# Altium schematic sheet [Acoustics] Hydrophone Process.SchDoc: Sample Sheet Title
size B; Date: 10/22/2023; Author: Nathan A, Rebecca Y, Rebecca L; Organization: ORGANIZATION; Address1: ADDRESS 1; Address2: ADDRESS 2; Address3: ADDRESS 3; Address4: ADDRESS 4; Revision: -; SheetNumber: 2; SheetTotal: 6; ENG_APP_DATE: --/--/--; DSN_APP_DATE: --/--/--; CHK_APP_DATE: --/--/--
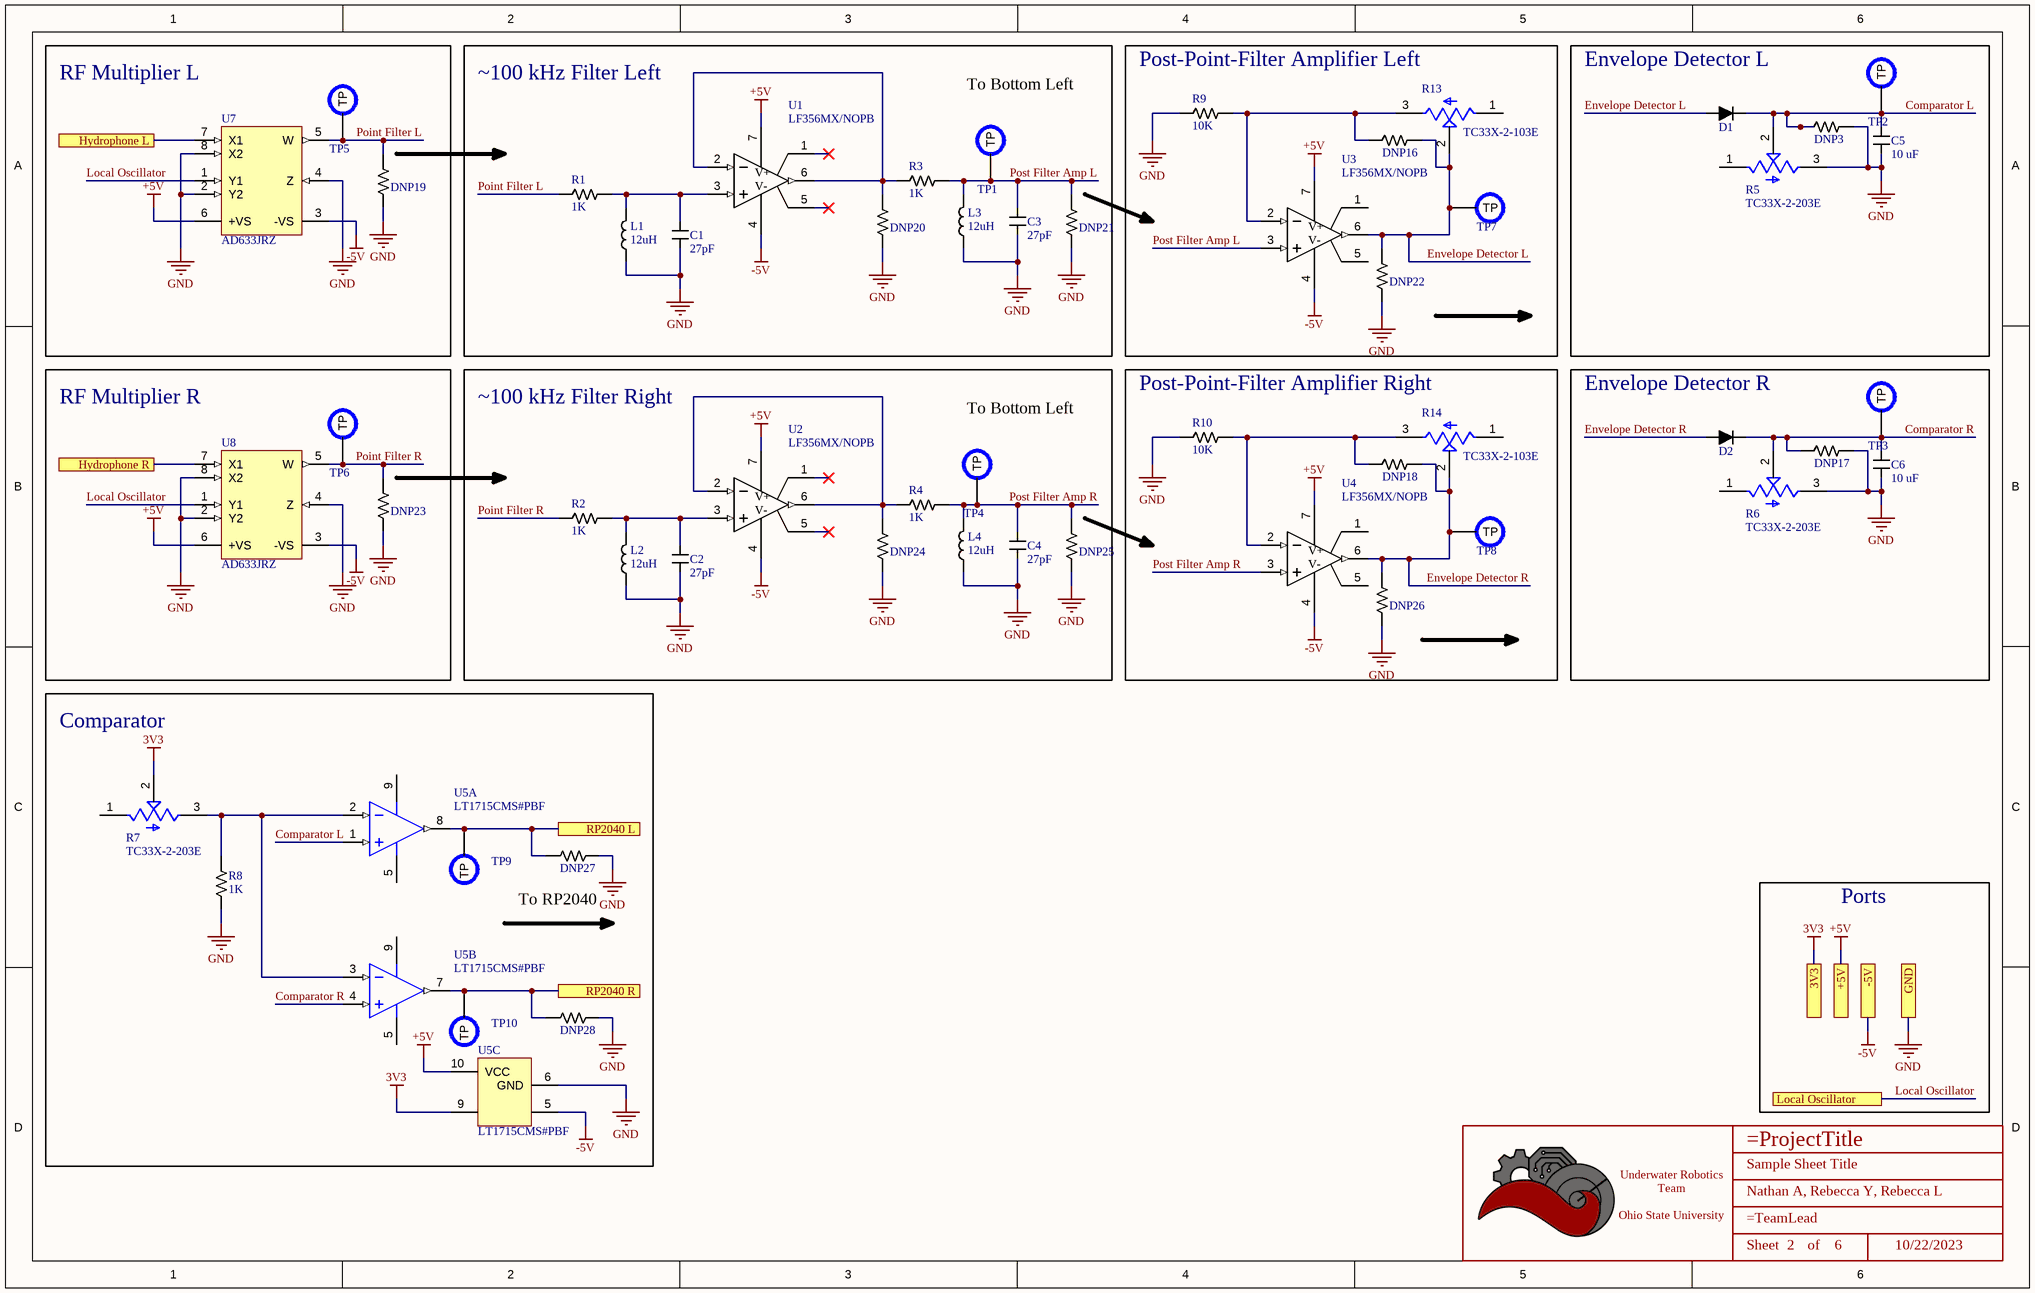
[diagram p0: [Acoustics] Hydrophone Process.SchDoc]

## Parts
*  Title_Block  [LOGO]  (value not drawn)  (graphical)
C1  value 27pF  [CAPACITOR_0603]  (hidden comment: 27pF Ceramic 50V)
C2  value 27pF  [CAPACITOR_0603]  (hidden comment: 27pF Ceramic 50V)
C3  value 27pF  [CAPACITOR_0603]  (hidden comment: 27pF Ceramic 50V)
C4  value 27pF  [CAPACITOR_0603]  (hidden comment: 27pF Ceramic 50V)
C5  Value (uF): 10 uF  [CAPACITOR_0603]  (hidden comment: 10uF Ceramic 6.3V)
C6  Value (uF): 10 uF  [CAPACITOR_0603]  (hidden comment: 10uF Ceramic 6.3V)
D1  BAR9002ELE6327XTMA1  [DIODE_0402]  (value not drawn)
D2  BAR9002ELE6327XTMA1  [DIODE_0402]  (value not drawn)
DNP3  DNP  [RESISTOR_0402]  (value not drawn)
DNP16  DNP  [RESISTOR_0402]  (value not drawn)
DNP17  DNP  [RESISTOR_0402]  (value not drawn)
DNP18  DNP  [RESISTOR_0402]  (value not drawn)
DNP19  DNP  [RESISTOR_0402]  (value not drawn)
DNP20  DNP  [RESISTOR_0402]  (value not drawn)
DNP21  DNP  [RESISTOR_0402]  (value not drawn)
DNP22  DNP  [RESISTOR_0402]  (value not drawn)
DNP23  DNP  [RESISTOR_0402]  (value not drawn)
DNP24  DNP  [RESISTOR_0402]  (value not drawn)
DNP25  DNP  [RESISTOR_0402]  (value not drawn)
DNP26  DNP  [RESISTOR_0402]  (value not drawn)
DNP27  DNP  [RESISTOR_0402]  (value not drawn)
DNP28  DNP  [RESISTOR_0402]  (value not drawn)
L1  value 12uH  [INDUCTOR_0603]  (hidden comment: FIXED IND 12UH 10MA 1.8 OHM SMD)
L2  value 12uH  [INDUCTOR_0603]  (hidden comment: FIXED IND 12UH 10MA 1.8 OHM SMD)
L3  value 12uH  [INDUCTOR_0603]  (hidden comment: FIXED IND 12UH 10MA 1.8 OHM SMD)
L4  value 12uH  [INDUCTOR_0603]  (hidden comment: FIXED IND 12UH 10MA 1.8 OHM SMD)
R1  Value  (Ohms): 1K  [RESISTOR_0603]  (hidden comment: 1k Ohm 5% 1/8W)
R2  Value  (Ohms): 1K  [RESISTOR_0603]  (hidden comment: 1k Ohm 5% 1/8W)
R3  Value  (Ohms): 1K  [RESISTOR_0603]  (hidden comment: 1k Ohm 5% 1/8W)
R4  Value  (Ohms): 1K  [RESISTOR_0603]  (hidden comment: 1k Ohm 5% 1/8W)
R5  TC33X-2-203E  [TRIM_TC33X-2-203E]
R6  TC33X-2-203E  [TRIM_TC33X-2-203E]
R7  TC33X-2-203E  [TRIM_TC33X-2-203E]
R8  Value  (Ohms): 1K  [RESISTOR_0402]  (hidden comment: 1k Ohm 1% 1/16W)
R9  Value  (Ohms): 10K  [RESISTOR_0603]  (hidden comment: 10k Ohm 0.5% 1/10W)
R10  Value  (Ohms): 10K  [RESISTOR_0603]  (hidden comment: 10k Ohm 0.5% 1/10W)
R13  TC33X-2-103E  [TRIM_TC33X-2-203E]
R14  TC33X-2-103E  [TRIM_TC33X-2-203E]
TP1  PCB Test Point  [TESTPOINT_1.2MM]  (value not drawn)  (no BOM)
TP2  PCB Test Point  [TESTPOINT_1.2MM]  (value not drawn)  (no BOM)
TP3  PCB Test Point  [TESTPOINT_1.2MM]  (value not drawn)  (no BOM)
TP4  PCB Test Point  [TESTPOINT_1.2MM]  (value not drawn)  (no BOM)
TP5  PCB Test Point  [TESTPOINT_1.2MM]  (value not drawn)  (no BOM)
TP6  PCB Test Point  [TESTPOINT_1.2MM]  (value not drawn)  (no BOM)
TP7  PCB Test Point  [TESTPOINT_1.2MM]  (value not drawn)  (no BOM)
TP8  PCB Test Point  [TESTPOINT_1.2MM]  (value not drawn)  (no BOM)
TP9  PCB Test Point  [TESTPOINT_1.2MM]  (value not drawn)  (no BOM)
TP10  PCB Test Point  [TESTPOINT_1.2MM]  (value not drawn)  (no BOM)
U1  LF356MX/NOPB  [SOIC-8]
U2  LF356MX/NOPB  [SOIC-8]
U3  LF356MX/NOPB  [SOIC-8]
U4  LF356MX/NOPB  [SOIC-8]
U5  LT1715CMS#PBF  [LT-MS10_N]  (parts A,B,C of 3)
U7  AD633JRZ  [ADI-R-8_M]
U8  AD633JRZ  [ADI-R-8_M]

## Blocks framed on the sheet
RF Multiplier L: DNP19 TP5 U7
~100 kHz Filter Left: C1 C3 DNP20 DNP21 L1 L3 R1 R3 TP1 U1
Post-Point-Filter Amplifier Left: DNP16 DNP22 R9 R13 TP7 U3
Envelope Detector L: C5 D1 DNP3 R5 TP2
RF Multiplier R: DNP23 TP6 U8
~100 kHz Filter Right: C2 C4 DNP24 DNP25 L2 L4 R2 R4 TP4 U2
Post-Point-Filter Amplifier Right: DNP18 DNP26 R10 R14 TP8 U4
Envelope Detector R: C6 D2 DNP17 R6 TP3
Comparator: DNP27 DNP28 R7 R8 TP9 TP10 U5

## Ports
3V3, +5V, -5V, GND, Hydrophone L, Hydrophone R, Local Oscillator, RP2040 L, RP2040 R

## Nets
3V3: R7.2(W) U5.9(+VS) ; port 3V3
+5V: U1.7(V+) U2.7(V+) U3.7(V+) U4.7(V+) U5.10(VCC) U7.6(+VS) U8.6(+VS) ; port +5V
-5V: U1.4(V-) U2.4(V-) U3.4(V-) U4.4(V-) U5.5(VEE) U7.3(-VS) U8.3(-VS) ; port -5V
GND: C1.2 C2.2 C3.2 C4.2 C5.2 C6.2 DNP3.1 DNP17.1 DNP19.2 DNP20.2 DNP21.2 DNP22.2 DNP23.2 DNP24.2 DNP25.2 DNP26.2 DNP27.2 DNP28.2 L1.2 L2.2 L3.2 L4.2 R5.3(CW) R6.3(CW) R8.2 R9.2 R10.2 U5.6(GND) U7.2(Y2) U7.4(Z) U7.8(X2) U8.2(Y2) U8.4(Z) U8.8(X2) ; port GND
Comparator L: C5.1 D1.2 DNP3.2 R5.2(W) TP2.TP U5.1(+IN_A)
Comparator R: C6.1 D2.2 DNP17.2 R6.2(W) TP3.TP U5.4(+IN_B)
Envelope Detector L: D1.1 DNP16.1 DNP22.1 R13.2(W) TP7.TP U3.6(OUT)
Envelope Detector R: D2.1 DNP18.1 DNP26.1 R14.2(W) TP8.TP U4.6(OUT)
Hydrophone L: U7.7(X1) ; port Hydrophone L
Hydrophone R: U8.7(X1) ; port Hydrophone R
Local Oscillator: U7.1(Y1) U8.1(Y1) ; port Local Oscillator
Point Filter L: DNP19.1 R1.2 TP5.TP U7.5(W)
Point Filter R: DNP23.1 R2.2 TP6.TP U8.5(W)
Post Filter Amp L: C3.1 DNP21.1 L3.1 R3.1 TP1.TP U3.3(IN+)
Post Filter Amp R: C4.1 DNP25.1 L4.1 R4.1 TP4.TP U4.3(IN+)
RP2040 L: DNP27.1 TP9.TP U5.8(OUT_A) ; port RP2040 L
RP2040 R: DNP28.1 TP10.TP U5.7(OUT_B) ; port RP2040 R
NetC1_1: C1.1 L1.1 R1.1 U1.3(IN+)
NetC2_1: C2.1 L2.1 R2.1 U2.3(IN+)
NetDNP16_2: DNP16.2 R9.1 R13.3(CW) U3.2(IN-)
NetDNP18_2: DNP18.2 R10.1 R14.3(CW) U4.2(IN-)
NetDNP20_1: DNP20.1 R3.2 U1.2(IN-) U1.6(OUT)
NetDNP24_1: DNP24.1 R4.2 U2.2(IN-) U2.6(OUT)
NetR7_3: R7.3(CW) R8.1 U5.2(-IN_A) U5.3(-IN_B)

Not connected (* = marked no-connect by the designer): R5 1(CCW); R6 1(CCW); R7 1(CCW); R13 1(CCW); R14 1(CCW); U1 1(Balance)* 5(Balance)*; U2 1(Balance)* 5(Balance)*; U3 1(Balance) 5(Balance); U4 1(Balance) 5(Balance)

## Notes on the sheet
- To Bottom Left
- (near DNP27) To RP2040
- Ports
- DWG. NO.
- REV.
- SHT.
- THIS DOCUMENT AND THE DATA DISCLOSED HEREIN OR HEREWITH IS THE PROPERTY OF ALTIUM LIMITED AND MAY BE FREELY DISTRIBUTED IN WHOLE. NO RIGHTS ARE RESERVED OR EXPRESS OR IMPLIED WARANTEE GIVEN.
- REVISION
- DESCRIPTION
- DATE
- APPROVED
- ENG:
- APPROVALS
- PROJECT
- DSN:
- CHK:
- REFERENCE DOCUMENTS
- PROJECT REVISION:
- TITLE
- DOCUMENT REVISION:
- DESIGN ITEM:
- BOM:
- FAB DWG:
- PCB DWG:
- ASSY DWG:
- SCALE:
- SIZE
- B
- CAGE CODE
- FILE NAME
- DWG NO.
- SHEET
- OF
- REV
- (in symbol Title_Block) Underwater Robotics Team / Ohio State University; Sheet; of

## Library data of the parts
* = Title_Block: UWRT Schematic Title Block Template / Created June 2021, Dylan Trainor
C1-C4 = CAPACITOR_0.000027uF_0603: Cap 27pF 50V +/-5% / Ceramic 0603; Made By: Flip B; Tolerance: +/- 5%; Voltage: 50V; ComponentLink1Description: Datsheet; ComponentLink1URL: https://www.mouser.com/datasheet/2/212/KEM_C1002_X7R_SMD-1102033.pdf; Supplier 1: Digi-Key; Supplier Part Number 1: 311-1063-1-ND
C5 C6 = CAPACITOR_10uF_0603: Cap 10uF 6.3V +/-20% / Ceramic 0603; Made By: Flip B; ComponentLink1Description: Digikey; ComponentLink1URL: https://www.digikey.com/en/products/detail/samsung-electro-mechanics/CL10A106MQ8NNNC/3886777; Supplier 1: Digi-Key; Supplier Part Number 1: 1276-1119-1-ND; Tolerance: +/- 20%; Voltage: 6.3V
D1 D2 = RF Diode 80V 100mA: RF Diode PIN - Single 80V 100 mA 250 mW PG-TSLP-2-19; Forward Current: 100mA; Voltage - Peak Reverse: 80V; Package: 0402
DNP3 DNP16-DNP28 = DNP_0402: Do Not Populate 0402
L1-L4 = INDUCTOR_12uH_0603: 12 µH Shielded Multilayer Inductor 10 mA 1.8Ohm Max 0603 (1608 Metric); Tolerance: +/- 20%; Made By: Robert Pafford; DC Resistance: 36mOhm; Current Rating: 2.1A; Supplier 1: Arrow Electronics; Supplier Part Number 1: MLF1608E120JTD25
R1-R4 = RESISTOR_1K_0603: RES 1k OHM 5% 1/8W 0603; Tolerance: +/- 5%; Made By: Robert Pafford; ComponentLink1Description: Datasheet; ComponentLink1URL: https://www.bourns.com/docs/product-datasheets/CRxxxxx.pdf; Wattage: 1/8W; Supplier: Digikey; Digikey Part Numer: CR0603-JW-104ELFTR-ND; Supplier 1: Digi-Key; Supplier Part Number 1: 2019-RK73B1JTTD102JCT-ND
R5-R7 R13 R14 = TC33X-2-203E: 20 kOhms 0.1W, 1/10W J Lead Surface Mount Trimmer Potentiometer Cermet 1 Turn Top Adjustment; MF: Bourns; Value: *; SnapEDA_Link: https://www.snapeda.com/parts/TC33X-2-203E/Bourns/view-part/312812/?ref=snap; Check_prices: https://www.snapeda.com/parts/TC33X-2-203E/Bourns/view-part/312812/?ref=eda; Digi-Key_Part_Number: TC33X-2-203ECT-ND; Purchase-URL: https://pricing.snapeda.com/search/part/TC33X-2-203E/?ref=eda; Package: 1608 Bourns; MP: TC33X-2-203E; Supplier 1: Mouser; Supplier Part Number 1: 652-TC33X-2-203E
R8 = RESISTOR_1K_0402: RES 1k OHM 1% 1/16W 0402; Tolerance: +/- 1%; Made By: Robert Pafford; Wattage: 1/16W; Supplier: Digikey; Digikey Part Numer: CR0603-JW-104ELFTR-ND; Supplier 1: Digi-Key; Supplier Part Number 1: 13-AC0402FR-131KLCT-ND
R9 R10 = RESISTOR_10K_0.5%_0603: RES 10k OHM 0.5% 1/10W 0603; Tolerance: +/- 0.5%; Made By: Robert Pafford; Wattage: 1/10W; Supplier: Digikey; Digikey Part Numer: CR0603-JW-104ELFTR-ND; Supplier 1: Digi-Key; Supplier Part Number 1: 749-1695-1-ND
TP1-TP10 = TESTPOINT: Made By: Robert Pafford
U1-U4 = LM356MX/NOPB: IC OPAMP JFET 1 CIRCUIT 8SOIC; PartNumber: LM8261M5X/NOPB; Manufacturer: Texas Instruments; Supply Current: 1.3 mA; Supply Voltage: 2.5 V ~ 30 V, +/- 1.25 V ~ 15 V; Gain Bandwidth Product: 21 MHz; Created By: Dylan T; ComponentLink1Description: Digi-Key; ComponentLink1URL: https://www.digikey.com/en/products/detail/texas-instruments/LF356MX-NOPB/366701
U5 = CMP-0360-00164-2: 4 ns, 150 MHz Comparator with Independent Input / Output Supplies, 2 Channels, 2.7 to 12 V, 0 to +70 degC, 10-pin MSOP (MS10); Generic Part Number: LT1715; Manufacturer: Linear Technology; Prop Delay (us): 0.004; Vos (mV) Typical: 0.4; Channels (#): 2; Vs Min (V): 2.7; Supply Current (uA) Typical: 7500; Vos (mV) Guaranteed: 2.5; Vs Max (V): 12; Supply Voltage Range: 2.7 to 12 V; ComponentLink1Description: Manufacturer URL; ComponentLink1URL: http://www.linear.com/; RoHS: Y; ComponentLink2URL: http://cds.linear.com/docs/en/datasheet/1715fa.pdf; Features: Comparator, Separate In/Out Power Supply; Mounting Technology: Surface Mount; ComponentLink3URL: http://cds.linear.com/docs/en/packaging/MSOP_10_05-08-1661.pdf; ComponentLink3Description: Package Specification; PartNumber: LT1715CMS#PBF; PackageReference: MS10; ComponentLink2Description: Datasheet; PackageDescription: 10-Pin MSOP, Body 3 x 3 mm, Pitch 0.5 mm; DatasheetVersion: Rev A
U7 U8 = CMP-1592-00007-1: Low Cost Analog Multiplier, 20 V/us, 6 mA, 0 to 70 degC, 8-Pin SOIC (R), RoHS, Tube; PartNumber: AD633; Supply Current Max: 6 mA; Slew Rate: 20 V/us; Number of Channels: 2; DatasheetVersion: Rev. K; PackageDescription: 8-Pin Small Outline Package, Body 4.9 x 3.9 mm, Pitch 1.27 mm; PackageVersion: 06/2006; ComponentLink3Description: Package Specification; ComponentLink2Description: Datasheet; RoHS: TRUE; Mounting Technology: Surface Mount; ComponentLink1Description: Manufacturer URL; Packing: Tube; Code_JEDEC: MS-012-AA; ComponentLink1URL: http://www.analog.com/en/index.html; Temperature Max: 70 degC; Temperature Min: 0 degC; ComponentLink3URL: http://www.analog.com/media/en/package-pcb-resources/package/pkg_pdf/soic_narrow-r/r_8.pdf; ComponentLink2URL: http://www.analog.com/media/en/technical-documentation/data-sheets/AD633.pdf